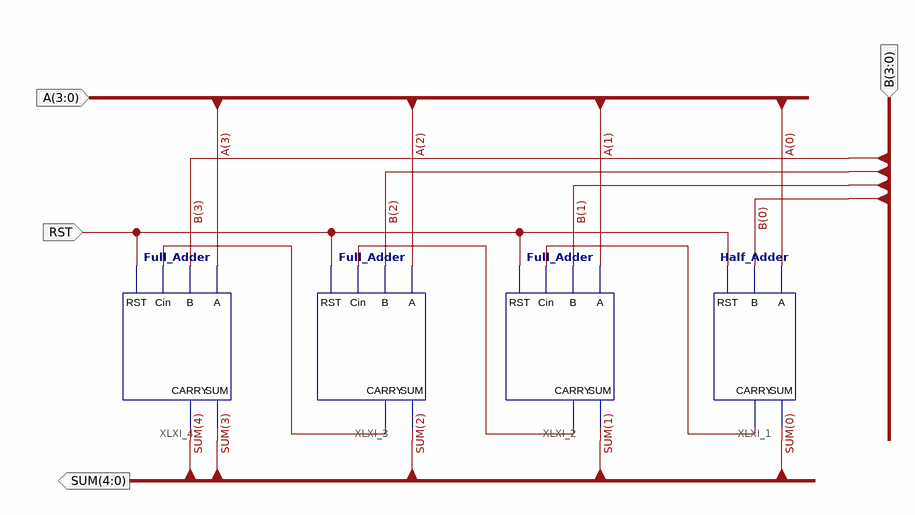
[diagram p0: schematic sheet 1]
// Xilinx ISE schematic Four_Bit_Adder.sch (spartan6) as structural Verilog: 4 symbols, 4 ports
module Four_Bit_Adder (
  input  RST,
  input  [3:0] A,
  input  [3:0] B,
  output [4:0] SUM
);

  wire XLXN_6, XLXN_7, XLXN_8;

  Half_Adder XLXI_1 (.A(A[0]), .B(B[0]), .CARRY(XLXN_6), .RST(RST), .SUM(SUM[0]));
  Full_Adder XLXI_2 (.A(A[1]), .B(B[1]), .CARRY(XLXN_7), .Cin(XLXN_6), .RST(RST), .SUM(SUM[1]));
  Full_Adder XLXI_3 (.A(A[2]), .B(B[2]), .CARRY(XLXN_8), .Cin(XLXN_7), .RST(RST), .SUM(SUM[2]));
  Full_Adder XLXI_4 (.A(A[3]), .B(B[3]), .CARRY(SUM[4]), .Cin(XLXN_8), .RST(RST), .SUM(SUM[3]));
endmodule
